# EasyEDA Pro project 2022-SS-ZT-1.eprj

# Schematic EDA_LQ——13P——u
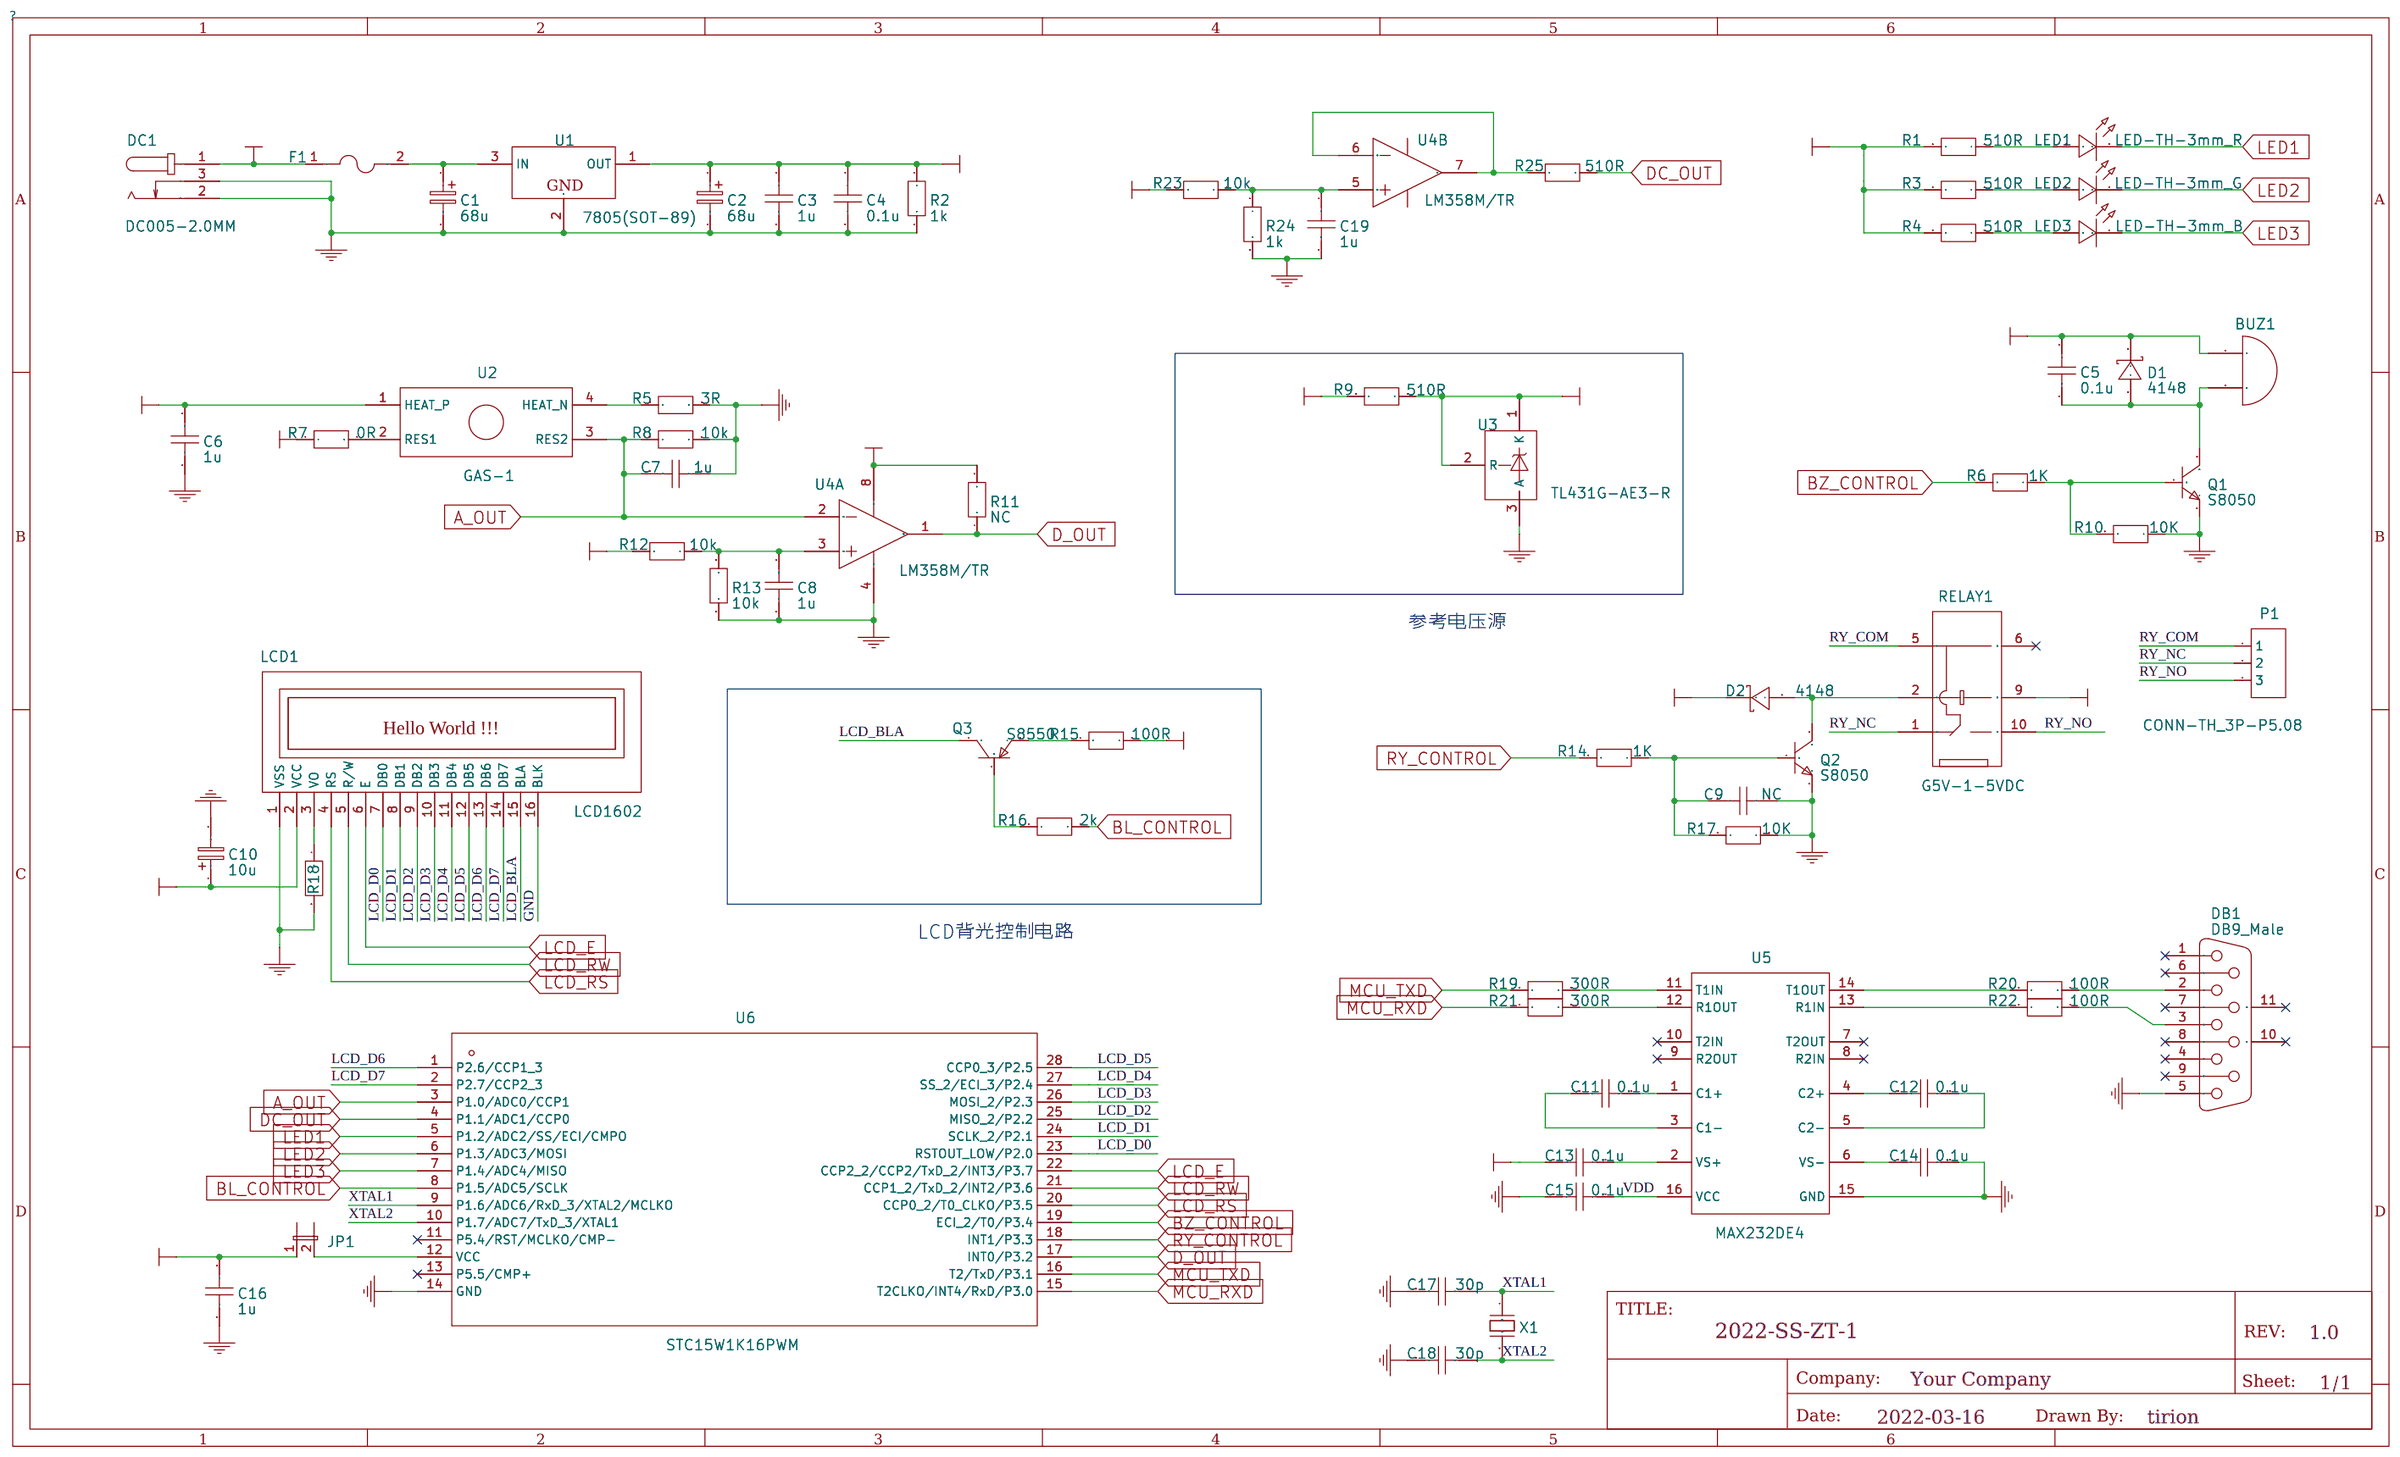
[diagram p0: schematic sheet]

## Parts
BUZ1  BUZ1  [BUZZ]
C1  68u  [CAP-D6.3×H5.5]
C2  68u  [CAP-D6.3×H5.5]
C3  1u  [C0805]
C4  0.1u  [C0805]
C5  0.1u  [C0805]
C6  1u  [C0805]
C7  1u  [C0805]
C8  1u  [C0805]
C9  NC  [C0805]
C10  10u  [CAP-D5.0×H5.5]
C11  0.1u  [C0805]
C12  0.1u  [C0805]
C13  0.1u  [C0805]
C14  0.1u  [C0805]
C15  0.1u  [C0805]
C16  1u  [C0805]
C17  30p  [C0805]
C18  30p  [C0805]
C19  1u  [C0805]
D1  4148  [SMA_L4.4-W2.8-LS5.4-RD]
D2  4148  [SMA_L4.4-W2.8-LS5.4-RD]
DB1  DB9_Male  [DSUB-TH_DMR-9P]
DC1  DC005-2.0MM  [DC-IN-TH_DC005]
F1  FUSE_F1812_FUSE  [F1812]
JP1  JUMPER2  [JUMPER2]
LCD1  LCD1602  [LCD1602]
LED1  LED-TH-3mm_R  [LED-TH_BD3.0_RED]
LED2  LED-TH-3mm_G  [LED-TH_BD3.0_GREEN]
LED3  LED-TH-3mm_B  [LED-TH_BD3.0_BLUE]
P1  CONN-TH_3P-P5.08  [CONN-TH_3P-P5.08]
Q1  S8050  [SOT-23-3_L2.9-W1.3-P1.90-LS2.4-BR]
Q2  S8050  [SOT-23-3_L2.9-W1.3-P1.90-LS2.4-BR]
Q3  S8550  [SOT-23-3_L2.9-W1.3-P1.90-LS2.4-BR]
R1  510R  [R0805]
R2  1k  [R0805]
R3  510R  [R0805]
R4  510R  [R0805]
R5  3R  [R0805]
R6  1K  [R0805]
R7  0R  [R0805]
R8  10k  [R0805]
R9  510R  [R0805]
R10  10K  [R0805]
R11  NC  [R0805]
R12  10k  [R0805]
R13  10k  [R0805]
R14  1K  [R0805]
R15  100R  [R0805]
R16  2k  [R0805]
R17  10K  [R0805]
R18  10k  [R0805]
R19  300R  [R0805]
R20  100R  [R0805]
R21  300R  [R0805]
R22  100R  [R0805]
R23  10k  [R0805]
R24  1k  [R0805]
R25  510R  [R0805]
RELAY1  G5V-1-5VDC  [RELAY-TH_G5V-1]
U1  7805(SOT-89)  [SOT-89-3_L4.5-W2.5-P1.50-LS4.2-BR]
U2  GAS-1  [GAS-1]
U3  TL431G-AE3-R  [SOT-23-3_L2.9-W1.3-P1.90-LS2.4-TR]
U4  LM358M/TR  [SOP-8_L4.9-W3.9-P1.27-LS6.0-BL]  (sections 1,2)
U5  MAX232DE4  [SOIC16N]
U6  STC15W1K16PWM  [SOP-28_L17.9-W7.5-P1.27-LS10.3-BL]
X1  12MHZ  [OSC-49U-1]

## Library data of the parts
BUZ1 = BUZ1
C1 C2 = 68u
C3 C6-C8 C16 C19 = 1u
C4 C5 C11-C15 = 0.1u
C9 R11 = NC
C10 = 10u
C17 C18 = 30p
D1 D2 = SS14: Supplier: LCSC; Manufacturer: MDD; Supplier Part: C2480; JLCPCB Part Class: Basic Part
DB1 = DB9_Male: Supplier Part: C185657; Supplier: LCSC; Manufacturer: Amphenol
DC1 = DC005-2.0MM: Supplier: LCSC; Manufacturer: SOFNG; Supplier Part: C111567
F1 = FUSE_F1812_FUSE: Supplier: LCSC; Supplier Part: C9900007509; JLCPCB Part Class: Extended Part
JP1 = JUMPER2: Jumper 2 Pin
LCD1 = LCM1602K-NSW-BBW: Manufacturer: LONTECH(厦门龙特); Supplier Part: C83275; Supplier: LCSC
LED1 = 204-10SDRD/S530-A3-L: Manufacturer: EVERLIGHT(台湾亿光); Supplier Part: C84774; Supplier: LCSC
LED2 = 204-10SYGD/S530-E3: Manufacturer: EVERLIGHT(台湾亿光); Supplier Part: C85161
LED3 = 204-10SUBC/S400-A4: Manufacturer: EVERLIGHT(台湾亿光); Supplier Part: C86881; Supplier: LCSC
P1 = CONN-TH_3P-P5.08: Supplier: LCSC
Q1 Q2 = S8050: Supplier: LCSC; Supplier Part: C916390; Manufacturer: JSMSEMI; JLCPCB Part Class: Extended Part
Q3 = S8550-H: Supplier: LCSC; Supplier Part: C699225; Manufacturer: Yangzhou Yangjie Elec Tech; JLCPCB Part Class: Extended Part
R1 R3 R4 R9 R25 = 510R
R2 R24 = 1k
R5 = 3R
R6 R14 = 1K
R7 = 0R
R8 R12 R13 R18 R23 = 10k
R10 R17 = 10K
R15 R20 R22 = 100R
R16 = 2k
R19 R21 = 300R
RELAY1 = G5V-1-5VDC: Supplier: LCSC; Manufacturer: OMRON; Supplier Part: C28695; JLCPCB Part Class: Extended Part
U1 = CJ78L05: Supplier: LCSC; Manufacturer: CJ; image: //image.lceda.cn/szlcsc/C2079.jpg; Supplier Part: C2079; Paste Type: expand
U2 = GAS-1
U3 = TL431G-AE3-R: Supplier: LCSC; Manufacturer: UTC; Supplier Part: C71130; JLCPCB Part Class: Extended Part
U4 = LM358M/TR: Supplier: LCSC; Supplier Part: C398078; Manufacturer: HGSEMI
U5 = MAX232DE4: Dual EIA-232 Driver  Receiver, 0 to 70 degC, 16-Pin SOIC (D), Green (RoHS  no SbBr)
U6 = STC15W1K16PWM: Supplier: LCSC; Manufacturer: STC; Supplier Part: C65670; JLCPCB Part Class: Extended Part
X1 = X49UD12MSD2SC: Supplier Part: undefined; Supplier: LCSC; Manufacturer: LCSC

## Nets
GND: C1.2 C2.2 C3.2 C4.2 C6.1 C7.1 C8.2 C9.2 C10.2 C14.2 C15.1 C16.1 C17.2 C18.2 C19.2 DB1.5 DC1.2 DC1.3 LCD1.1(VSS) LCD1.16(BLK) Q1.2(E) Q2.2(E) R2.2 R5.2 R8.2 R10.1 R13.2 R17.1 R18.2 R24.2 U1.2(GND) U3.3(A) U4.4(GND) U5.15(GND) U6.14(GND)
VDD: BUZ1.1(A) C2.1 C3.1 C4.1 C5.2 C6.2 C10.1 C13.1 C15.2 C16.2 D1.1(K) D2.1(K) JP1.1 LCD1.2(VCC) R1.2 R2.1 R3.2 R4.2 R9.2 R11.2 R15.2 RELAY1.9 U1.1(OUT) U2.1(HEAT_P) U4.8(VCC) U5.16(VCC)
A_OUT: C7.2 R8.1 U2.3(RES2) U4.2(1IN-) U6.3(P1.0/ADC0/CCP1)
BL_CONTROL: R16.2 U6.8(P1.5/ADC5/SCLK)
BZ_CONTROL: R6.2 U6.19(ECI_2/T0/P3.4)
D_OUT: R11.1 U4.1(1OUT) U6.17(INT0/P3.2)
DC_IN: DC1.1 F1.1 R23.2
DC_OUT: R25.1 U6.4(P1.1/ADC1/CCP0)
LCD_BLA: LCD1.15(BLA) Q3.3(C)
LCD_D0: LCD1.7(DB0) U6.23(RSTOUT_LOW/P2.0)
LCD_D1: LCD1.8(DB1) U6.24(SCLK_2/P2.1)
LCD_D2: LCD1.9(DB2) U6.25(MISO_2/P2.2)
LCD_D3: LCD1.10(DB3) U6.26(MOSI_2/P2.3)
LCD_D4: LCD1.11(DB4) U6.27(SS_2/ECI_3/P2.4)
LCD_D5: LCD1.12(DB5) U6.28(CCP0_3/P2.5)
LCD_D6: LCD1.13(DB6) U6.1(P2.6/CCP1_3)
LCD_D7: LCD1.14(DB7) U6.2(P2.7/CCP2_3)
LCD_E: LCD1.6(E) U6.22(CCP2_2/CCP2/TxD_2/INT3/P3.7)
LCD_RS: LCD1.4(RS) U6.20(CCP0_2/T0_CLKO/P3.5)
LCD_RW: LCD1.5(R/W) U6.21(CCP1_2/TxD_2/INT2/P3.6)
LED1: LED1.2 U6.5(P1.2/ADC2/SS/ECI/CMPO)
LED2: LED2.2 U6.6(P1.3/ADC3/MOSI)
LED3: LED3.2 U6.7(P1.4/ADC4/MISO)
MCU_RXD: R21.1 U6.15(T2CLKO/INT4/RxD/P3.0)
MCU_TXD: R19.1 U6.16(T2/TxD/P3.1)
RY_COM: P1.1 RELAY1.5
RY_CONTROL: R14.2 U6.18(INT1/P3.3)
RY_NC: P1.2 RELAY1.1
RY_NO: P1.3 RELAY1.10
VREF: R7.1 R9.1 R12.2 U3.1(K) U3.2(R)
XTAL1: C17.1 U6.9(P1.6/ADC6/RxD_3/XTAL2/MCLKO) X1.1(OSC1)
XTAL2: C18.1 U6.10(P1.7/ADC7/TxD_3/XTAL1) X1.2(OSC2)
$1N38: R5.1 U2.4(HEAT_N)
$1N129: C8.1 R12.1 R13.1 U4.3(1IN+)
$1N261: C11.2 U5.1(C1+)
$1N262: C11.1 U5.3(C1-)
$1N307: C13.2 U5.2(VS+)
$1N323: C12.1 U5.4(C2+)
$1N324: C12.2 U5.5(C2-)
$1N325: C14.1 U5.6(VS-)
$1N349: R19.2 U5.11(T1IN)
$1N361: R21.2 U5.12(R1OUT)
$1N384: R20.1 U5.14(T1OUT)
$1N385: DB1.2 R20.2
$1N395: R22.1 U5.13(R1IN)
$1N396: DB1.3 R22.2
$1N410: JP1.2 U6.12(VCC)
$1N453: D2.2(A) Q2.3(C) RELAY1.2
$1N454: C9.1 Q2.1(B) R14.1 R17.2
$1N534: Q1.1(B) R6.1 R10.2
$1N571: BUZ1.2(B) C5.1 D1.2(A) Q1.3(C)
$1N627: LCD1.3(VO) R18.1
$1N796: LED1.1 R1.1
$1N816: LED3.1 R4.1
$1N817: LED2.1 R3.1
$1N913: C1.1 F1.2 U1.3(IN)
$1N974: R25.2 U4.6(2IN-) U4.7(2OUT)
$1N997: C19.1 R23.1 R24.1 U4.5(2IN+)
$1N1047: R7.2 U2.2(RES1)
$1N2187: Q3.2(E) R15.1
$1N2198: Q3.1(B) R16.1

Not connected (* = marked no-connect by the designer): DB1 1* 4* 6* 7* 8* 9* 10(MH1)* 11(MH2)*; RELAY1 6*; U5 7(T2OUT)* 8(R2IN)* 9(R2OUT)* 10(T2IN)*; U6 11(P5.4/RST/MCLKO/CMP-)* 13(P5.5/CMP+)*

## Notes on the sheet
- 参考电压源
- LCD背光控制电路

# Board PCB
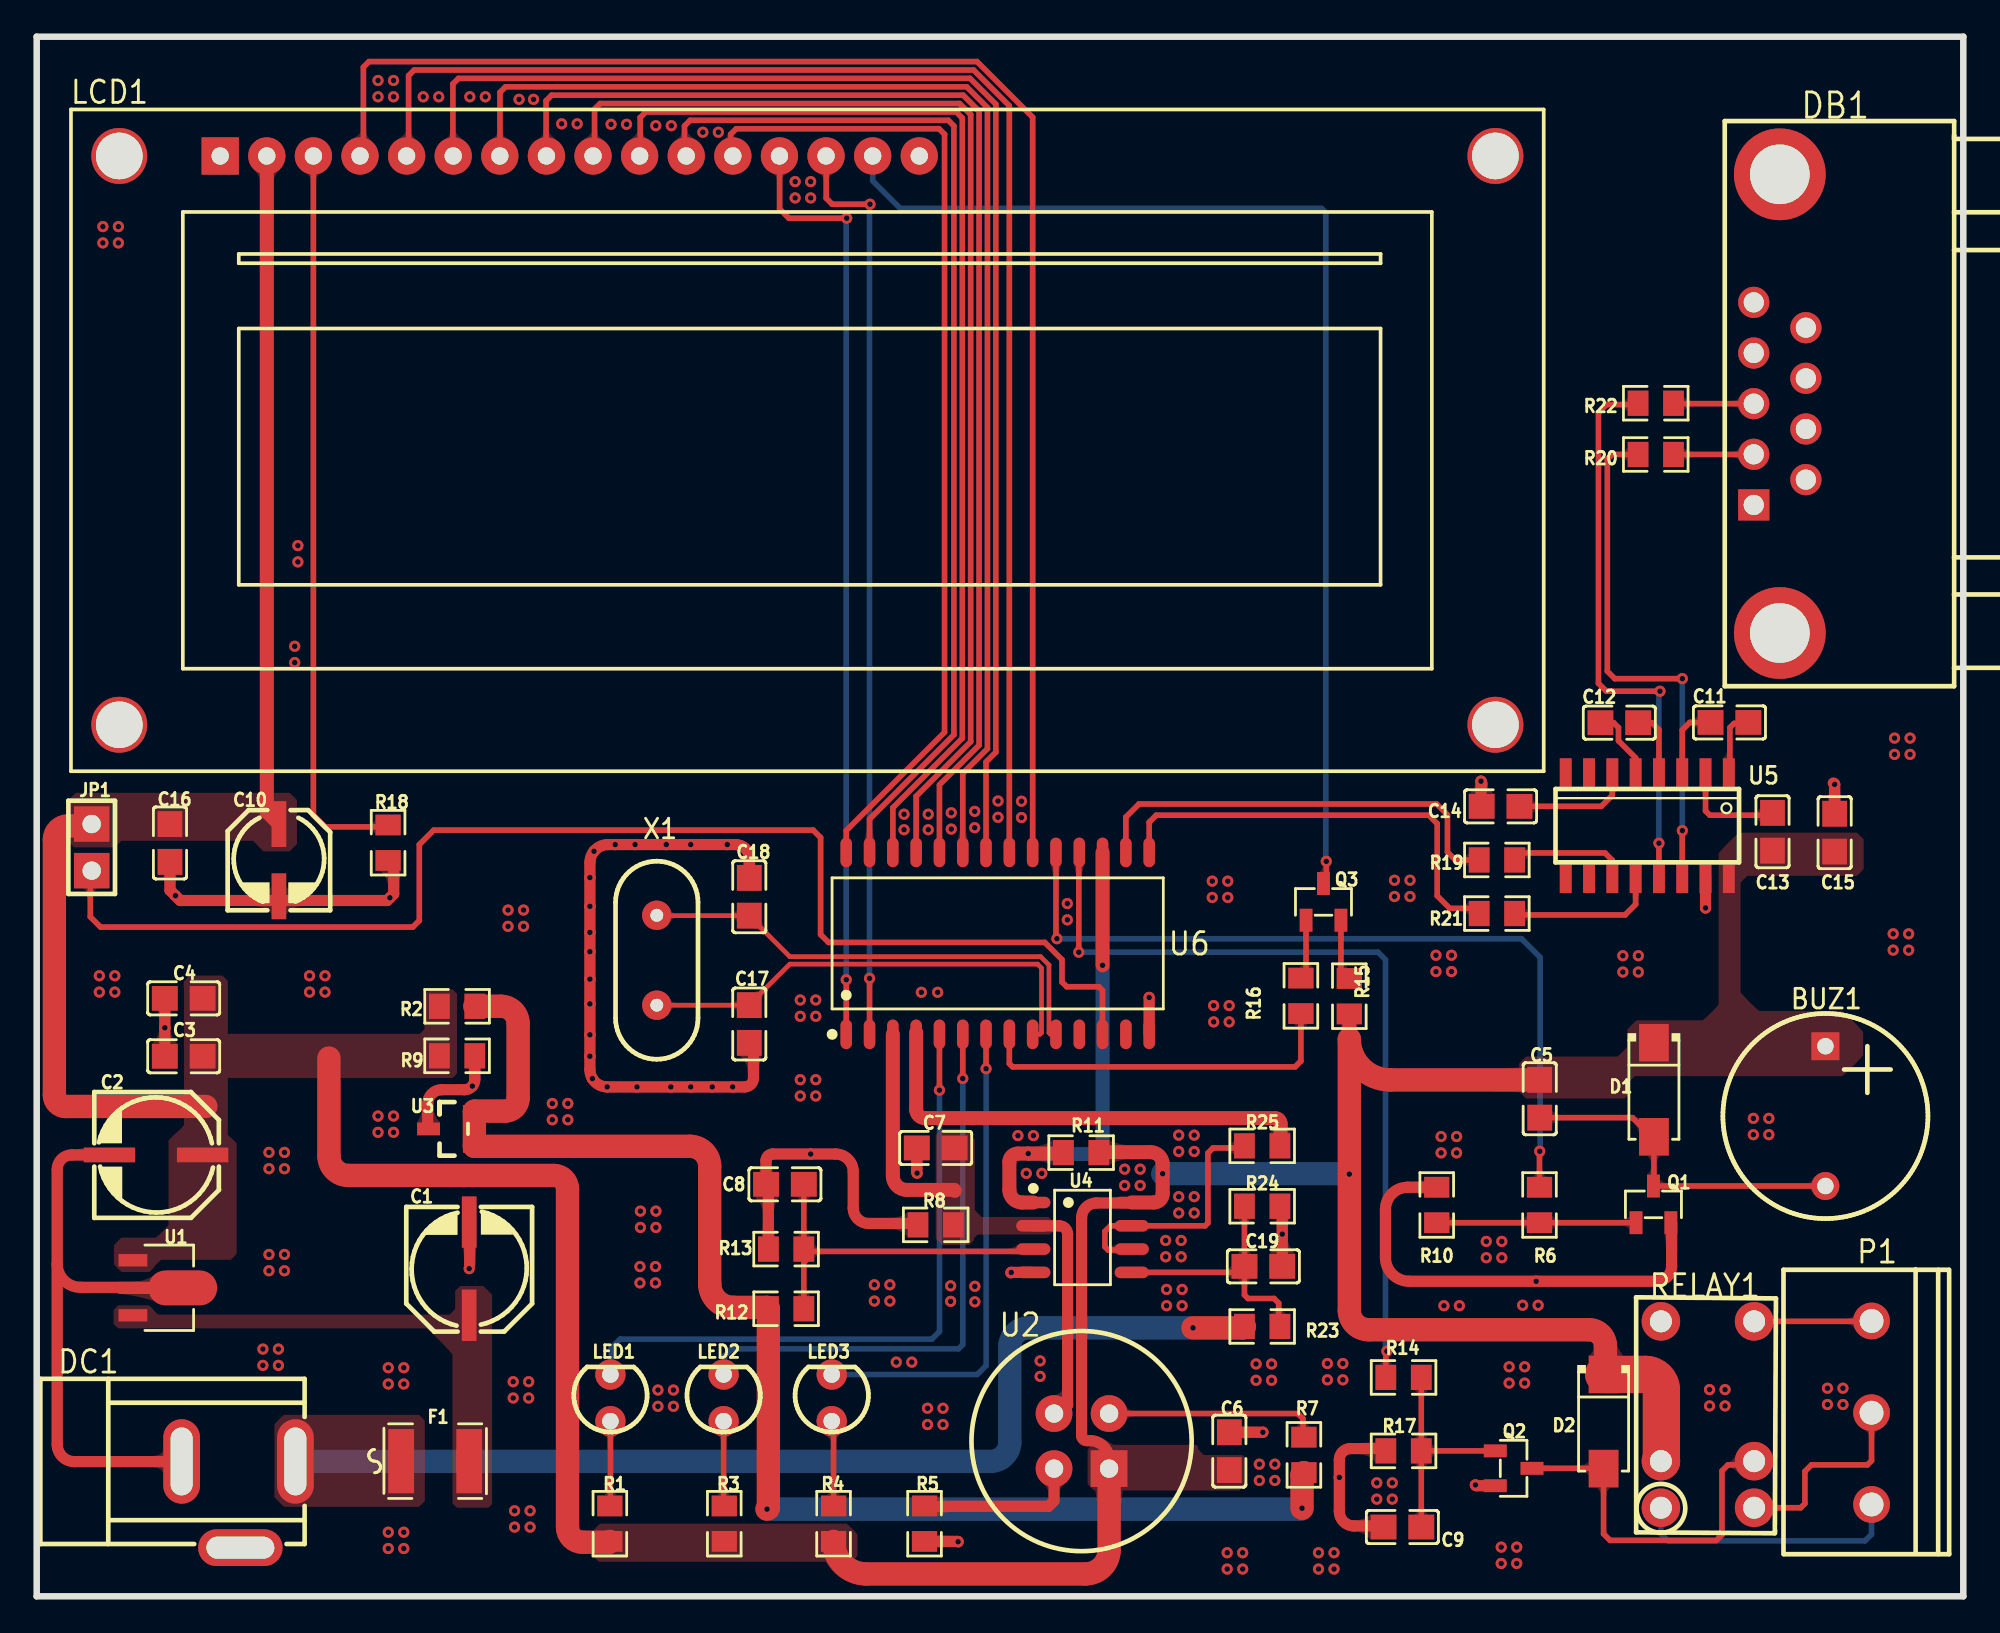
[diagram p1: board, top side]
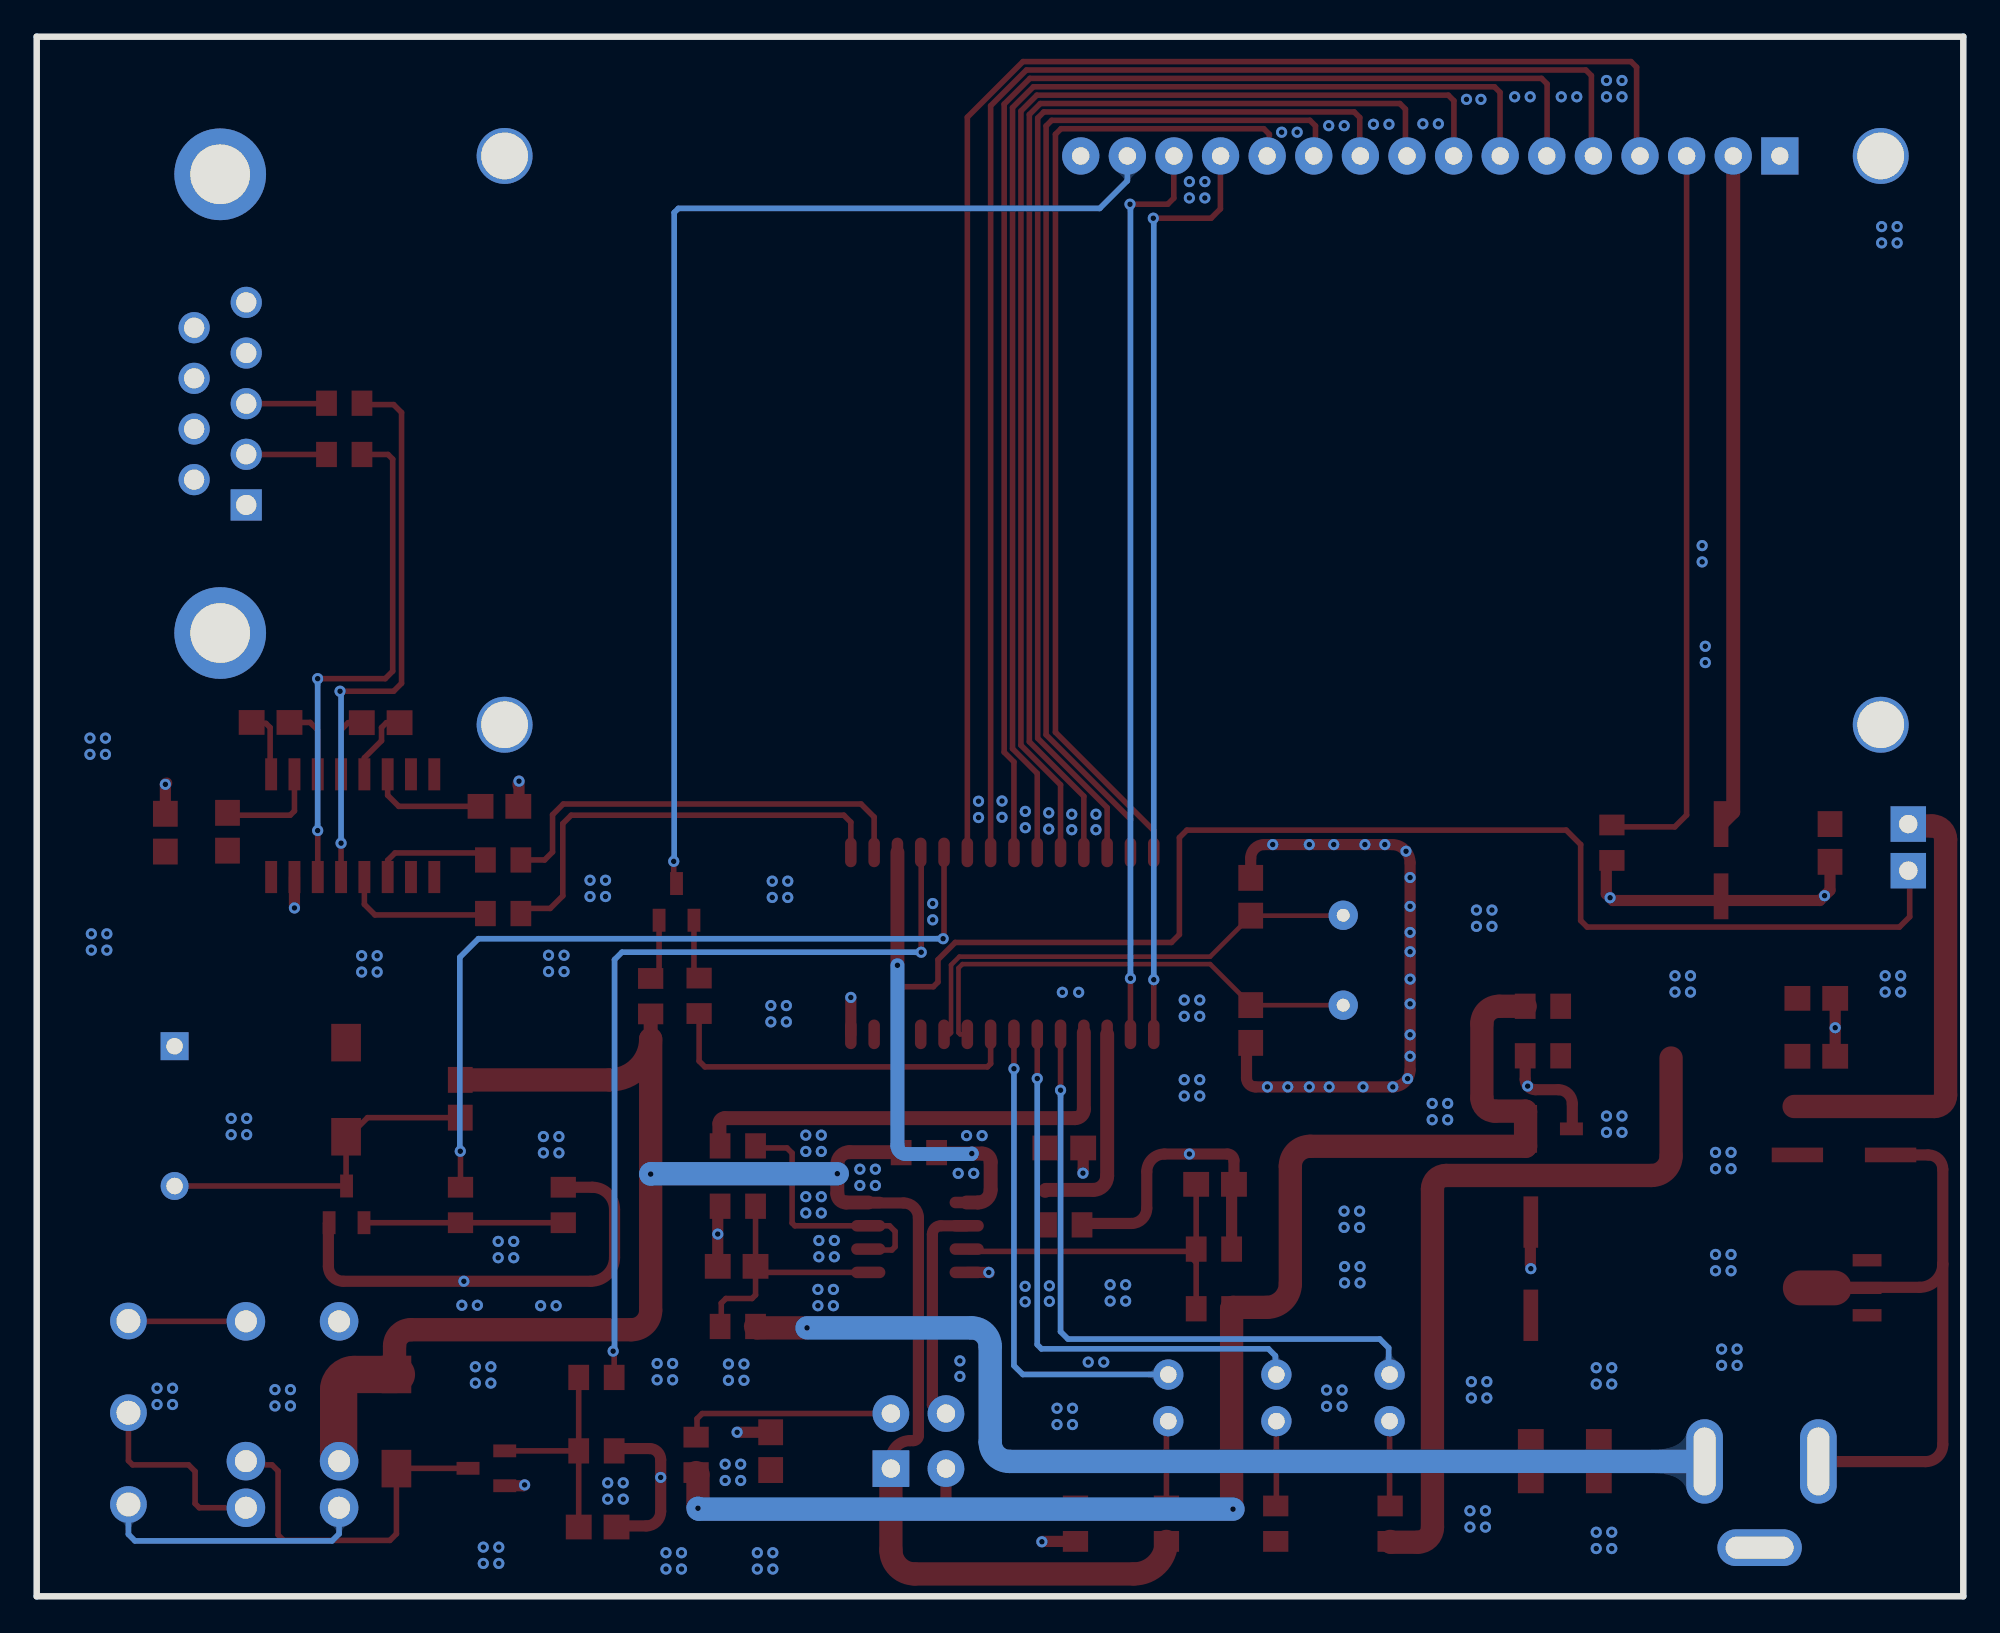
[diagram p2: board, bottom side, seen from below]

Outline 105 x 85 mm; copper layers: Top Layer, Bottom Layer. Coordinates in mm from the lower left corner of the outline.
Outline path: 0,85 105,85 105,0 0,0 0,85
Stack: Top Layer 0.035mm / Dielectric1 1.51mm FR4 er 4.5 / Bottom Layer 0.035mm

## Design rules (mm)
net XTAL1: DP1
net XTAL2: DP1
template: 用户自定义配置
spacing Default (default): track to track 0.152, other pairs 0 to 0.152
track width Default (default): min 0.305, default 0.305, max 25.4
track width PWR: min 0.305, default 0.61, max 2.54
differential pair differentialPair (default): width min 0.127, default 0.254, max 2.54; gap min 0.152, default 0.152
via Default (default): diameter min 0.61, default 0.61, max 100.025; hole min 0.305, default 0.305, max 59.995
net VDD uses PWR
net GND uses PWR
net VREF uses PWR
net DC_OUT uses PWR
net DC_IN uses PWR

## Placement (name value [footprint] x y rotation side)
BUZ1  BUZ1  [BUZZ]  97.49 29.98 270 top
C1  68u  [CAP-D6.3×H5.5]  23.57 20.4 270 top
C2  68u  [CAP-D6.3×H5.5]  3.96 24.05 0 top
C3  1u  [C0805]  8.01 29.43 180 top
C4  0.1u  [C0805]  8.01 32.59 180 top
C5  0.1u  [C0805]  81.91 27.12 90 top
C6  1u  [C0805]  65 7.91 270 top
C7  1u  [C0805]  49 24.44 0 top
C8  1u  [C0805]  40.78 22.45 180 top
C9  NC  [C0805]  74.43 3.78 180 top
C10  10u  [CAP-D5.0×H5.5]  13.2 38.15 90 top
C11  0.1u  [C0805]  92.25 47.63 0 top
C12  0.1u  [C0805]  86.25 47.61 180 top
C13  0.1u  [C0805]  94.6 41.67 90 top
C14  0.1u  [C0805]  79.78 43.05 180 top
C15  0.1u  [C0805]  97.99 41.62 270 top
C16  1u  [C0805]  7.26 41.06 90 top
C17  30p  [C0805]  38.84 31.19 270 top
C18  30p  [C0805]  38.84 38.13 90 top
C19  1u  [C0805]  66.85 17.98 0 top
D1  4148  [SMA_L4.4-W2.8-LS5.4-RD]  88.14 27.61 270 top
D2  4148  [SMA_L4.4-W2.8-LS5.4-RD]  85.4 9.53 270 top
DB1  DB9_Male  [DSUB-TH_DMR-9P]  95 65 0 top
DC1  DC005-2.0MM  [DC-IN-TH_DC005]  11 5 0 top
F1  FUSE_F1812_FUSE  [F1812]  21.72 7.37 0 top
JP1  -  [JUMPER2]  3 40.82 90 top
LCD1  -  [LCD1602]  42 63 0 top
LED1  LED-TH-3mm_R  [LED-TH_BD3.0_RED]  31.27 10.82 180 top
LED2  LED-TH-3mm_G  [LED-TH_BD3.0_GREEN]  37.44 10.82 180 top
LED3  LED-TH-3mm_B  [LED-TH_BD3.0_BLUE]  43.33 10.82 180 top
P1  -  [CONN-TH_3P-P5.08]  100 10 270 top
Q1  S8050  [SOT-23-3_L2.9-W1.3-P1.90-LS2.4-BR]  88.11 21.36 270 top
Q2  S8050  [SOT-23-3_L2.9-W1.3-P1.90-LS2.4-BR]  80.49 6.98 180 top
Q3  S8550  [SOT-23-3_L2.9-W1.3-P1.90-LS2.4-BR]  70.13 37.85 270 top
R1  510R  [R0805]  31.24 3.96 270 top
R2  1k  [R0805]  22.91 29.46 0 top
R3  510R  [R0805]  37.47 3.96 270 top
R4  510R  [R0805]  43.43 3.96 270 top
R5  3R  [R0805]  48.39 3.96 270 top
R6  1K  [R0805]  81.9 21.33 90 top
R7  0R  [R0805]  69.06 7.71 90 top
R8  10k  [R0805]  49 20.24 180 top
R9  510R  [R0805]  22.91 32.16 180 top
R10  10K  [R0805]  76.3 21.33 270 top
R11  NC  [R0805]  56.92 24.18 0 top
R12  10k  [R0805]  40.84 15.67 180 top
R13  10k  [R0805]  40.84 18.92 180 top
R14  1K  [R0805]  74.49 11.93 180 top
R15  100R  [R0805]  71.54 32.71 270 top
R16  2k  [R0805]  68.9 32.73 270 top
R17  10K  [R0805]  74.49 7.93 0 top
R18  10k  [R0805]  19.15 41.07 270 top
R19  300R  [R0805]  79.58 40.13 0 top
R20  100R  [R0805]  88.24 62.23 0 top
R21  300R  [R0805]  79.58 37.21 0 top
R22  100R  [R0805]  88.24 65.02 0 top
R23  10k  [R0805]  66.79 14.71 180 top
R24  1k  [R0805]  66.79 21.26 0 top
R25  510R  [R0805]  66.79 24.55 180 top
RELAY1  G5V-1-5VDC  [RELAY-TH_G5V-1]  91.06 9.91 90 top
U1  7805(SOT-89)  [SOT-89-3_L4.5-W2.5-P1.50-LS4.2-BR]  6.6 16.82 180 top
U2  -  [GAS-1]  58.45 6.96 180 top
U3  TL431G-AE3-R  [SOT-23-3_L2.9-W1.3-P1.90-LS2.4-TR]  22.61 25.48 0 top
U4  LM358M/TR  [SOP-8_L4.9-W3.9-P1.27-LS6.0-BL]  57 19.56 270 top
U5  MAX232DE4  [SOIC16N]  87.78 42 180 top
U6  STC15W1K16PWM  [SOP-28_L17.9-W7.5-P1.27-LS10.3-BL]  52.38 35.59 0 top
X1  12MHZ  [OSC-49U-1]  33.79 34.67 180 top

## Footprints (pads in the part's own frame, mm; a bottom-side part is the same pattern mirrored in y, then rotated)
BUZZ
  rect 1.524x1.524 hole 0.894x0.889: 1(0,0)
  round 1.524 hole 0.894x0.889: 2(7.62,0)
C0805
  rect 1.41x1.35 smd: 1(-1.03,0) 2(1.03,0)
CAP-D5.0×H5.5
  rect 2.5x0.8 smd: 1(3.937,0) 2(0,0)
CAP-D6.3×H5.5
  rect 2.8x0.8 smd: 1(5.08,0) 2(0,0)
CONN-TH_3P-P5.08
  round 2 hole 1.3: 1(-5.005,0) 2(-0.005,0) 3(4.995,0)
DC-IN-TH_DC005
  oval 2x4.6 hole 1.2x3.7: 1(3.1,2.35) 2(-3.1,2.35)
  oval 4.6x2 hole 3.7x1.2: 3(0.1,-2.35)
DSUB-TH_DMR-9P
  rect 1.7x1.7 hole 1.1: 1(-1.42,-5.52)
  round 1.7 hole 1.1: 2(-1.42,-2.76) 3(-1.42,0) 4(-1.42,2.76) 5(-1.42,5.52) 6(1.42,-4.14) 7(1.42,-1.38) 8(1.42,1.38) 9(1.42,4.14)
  round 5 hole 3.25: 10(0,12.5) 11(0,-12.5)
F1812
  rect 1.407x3.499 smd: 1(-1.853,0) 2(1.853,0)
GAS-1
  rect 2x2 hole 1: 1(0,0)
  round 2 hole 1: 2(0,-3) 3(3,-3) 4(3,0)
JUMPER2
  rect 1.931x1.931 hole 1.001: 1(1.27,0) 2(-1.27,0)
LCD1602
  round 3.048 hole 2.545x2.54: 0(-37.5,15.5) 17(-37.5,-15.5) 18(37.5,15.5) 19(37.5,-15.5)
  rect 2.032x2.032 hole 0.945: 1(-32,15.5)
  round 2.032 hole 0.945: 2(-29.46,15.5) 3(-26.92,15.5) 4(-24.38,15.5) 5(-21.84,15.5) 6(-19.3,15.5) 7(-16.76,15.5) 8(-14.22,15.5) 9(-11.68,15.5) 10(-9.14,15.5) 11(-6.6,15.5) 12(-4.06,15.5) 13(-1.52,15.5) 14(1.02,15.5) 15(3.56,15.5) 16(6.1,15.5)
LED-TH_BD3.0_BLUE
  round 1.651 hole 0.9: 1(0,1.27) 2(0,-1.27)
LED-TH_BD3.0_GREEN
  round 1.651 hole 0.9: 1(0,1.27) 2(0,-1.27)
LED-TH_BD3.0_RED
  round 1.651 hole 0.9: 1(0,1.27) 2(0,-1.27)
OSC-49U-1
  round 1.6 hole 0.7: 1(0,2.45) 2(0,-2.45)
R0805
  rect 1.133x1.377 smd: 1(-0.966,0) 2(0.966,0)
RELAY-TH_G5V-1
  round 2.1 hole 1.2: 1(-5.08,-2.54) 2(-2.54,-2.54) 5(5.08,-2.54) 6(5.08,2.54) 9(-2.54,2.54) 10(-5.08,2.54)
SMA_L4.4-W2.8-LS5.4-RD
  rect 2.046x1.62 smd: 1(-2.566,0) 2(2.566,0)
SOIC16N
  rect 0.65x1.75 smd: 1(-4.445,-2.799) 2(-3.175,-2.799) 3(-1.905,-2.799) 4(-0.635,-2.799) 5(0.635,-2.799) 6(1.905,-2.799) 7(3.175,-2.799) 8(4.445,-2.799) 9(4.445,2.799) 10(3.175,2.799) 11(1.905,2.799) 12(0.635,2.799) 13(-0.635,2.799) 14(-1.905,2.799) 15(-3.175,2.799) 16(-4.445,2.799)
SOP-8_L4.9-W3.9-P1.27-LS6.0-BL
  oval 0.63x1.865 smd: 1(-1.905,-2.683) 2(-0.635,-2.683) 3(0.635,-2.683) 4(1.905,-2.683) 5(1.905,2.683) 6(0.635,2.683) 7(-0.635,2.683) 8(-1.905,2.683)
SOP-28_L17.9-W7.5-P1.27-LS10.3-BL
  oval 0.63x1.615 smd: 1(-8.255,-4.957) 2(-6.985,-4.957) 3(-5.715,-4.957) 4(-4.445,-4.957) 5(-3.175,-4.957) 6(-1.905,-4.957) 7(-0.635,-4.957) 8(0.635,-4.957) 9(1.905,-4.957) 10(3.175,-4.957) 11(4.445,-4.957) 12(5.715,-4.957) 13(6.985,-4.957) 14(8.255,-4.957) 15(8.255,4.957) 16(6.985,4.957) 17(5.715,4.957) 18(4.445,4.957) 19(3.175,4.957) 20(1.905,4.957) 21(0.635,4.957) 22(-0.635,4.957) 23(-1.905,4.957) 24(-3.175,4.957) 25(-4.445,4.957) 26(-5.715,4.957) 27(-6.985,4.957) 28(-8.255,4.957)
SOT-23-3_L2.9-W1.3-P1.90-LS2.4-BR
  rect 1.25x0.7 smd: 1(1,-0.95) 2(1,0.95) 3(-1,0)
SOT-23-3_L2.9-W1.3-P1.90-LS2.4-TR
  rect 1.25x0.7 smd: 1(1.25,0.95) 2(1.25,-0.95) 3(-1.25,0)
SOT-89-3_L4.5-W2.5-P1.50-LS4.2-BR
  rect 1.575x0.672 smd: 1(1.356,-1.5) 3(1.356,1.5)
  custom 5.377x1.9 smd: 2(-1.356,0.009)

## Nets
As in the schematic.

Pads without a net: DB1 1 4 6 7 8 9 10 11; LCD1 0 17 18 19; RELAY1 6; U5 7 8 9 10; U6 11 13

## Via types
v1: diameter 0.61, hole 0.305, Top Layer to Bottom Layer, 300 vias

## Routing (per net, layer and track width the routed paths; a pad name or vN(x,y) marks a point on that pad's centre or on a via; arc(x,y) is an arc through that point)
GND: length 163.1
  Top Layer w0.61: 1.12,18.11 1.12,23.27 arc(1.35,23.82) 1.91,24.05 C2.2 ; 1.12,18.11 1.12,8.28 arc(1.39,7.62) 2.06,7.34 7.89,7.34 arc(7.9,7.34) DC1.2 ; 1.12,18.11 arc(1.49,17.21) 2.39,16.84 7.92,16.84 arc(7.95,16.83) U1.2 ; C4.2 v1(6.98,30.99) C3.2 ; C18.2 38.84,40.23 arc(38.62,40.75) 38.1,40.97 v1(37.64,40.97) v1(35.64,40.97) v1(34.31,40.97) v1(32.61,40.97) v1(31.53,40.97) 31.14,40.97 arc(30.72,40.87) v1(30.37,40.61) arc(30.21,40.31) 30.15,39.98 v1(30.15,39.17) v1(30.15,37.61) v1(30.15,36.19) v1(30.15,35.13) v1(30.15,33.64) v1(30.15,32.29) v1(30.15,30.6) v1(30.15,29.43) 30.15,28.7 arc(30.18,28.45) v1(30.29,28.21) arc(30.63,27.88) v1(31.09,27.76) v1(32.71,27.76) v1(34.56,27.76) v1(35.64,27.76) v1(36.82,27.76) v1(37.93,27.76) 38.58,27.76 arc(38.92,27.9) 39.06,28.25 39.06,29.93 arc(39,30.09) C17.2 ; 12.97,37.92 19.1,37.92 19.46,38.28 19.46,39.8 R18.2 ; 12.97,37.92 C10.2 ; 12.97,37.92 7.82,37.92 v1(7.56,38.18) 7.26,38.48 C16.1 ; U5.15 v1(90.95,37.52) ; C6.1 v1(66.83,8.94) ; C19.2 v1(67.88,19.74) 67.88,21.13 arc(67.85,21.22) R24.2 ; R2.2 23.88,28.17 arc(23.84,27.98) v1(23.74,27.81) arc(23.55,27.66) 23.32,27.61 22.07,27.61 arc(21.53,27.39) 21.31,26.85 21.31,25.52 arc(21.32,25.49) U3.3 ; v1(60.63,32.64) U6.14 ; R5.2 50.2,2.99 arc(50.21,2.99) v1(50.22,2.97) ; Q2.2 78.46,6.03 arc(78.42,6.04) v1(78.41,6.07) ; C15.1 v1(97.99,44.25) arc(97.97,44.3) 97.92,44.32 ; U4.4 v1(53.11,17.65) arc(53.09,17.65) 53.09,17.63 ; R10.1 74.72,22.29 arc(73.86,21.94) 73.51,21.08 73.51,18.47 arc(73.89,17.55) 74.8,17.17 v1(81.72,17.17) 88.29,17.17 arc(88.87,17.41) 89.1,17.98 89.1,20.32 arc(89.09,20.35) Q1.2 ; C7.1 47.97,23.28 arc(47.95,23.17) v1(47.98,23.06) ; R13.2 39.88,22.33 arc(39.84,22.42) C8.2 39.75,23.75 arc(39.85,24) 40.11,24.1 v1(42.18,24.1) 43.54,24.1 arc(44.22,23.82) 44.5,23.14 44.5,21.16 arc(44.75,20.57) 45.34,20.32 47.95,20.32 arc(48.01,20.3) R8.2 ; 23.6,18.09 23.6,20.37 arc(23.59,20.39) C1.2 ; C14.2 78.71,43.09 v1(78.71,44.42) arc(78.76,44.32) 78.77,44.2 ; R17.1 arc(73.49,8.01) 73.4,8.05 71.6,8.05 arc(71.17,7.87) 70.99,7.44 v1(70.99,6.48) 70.99,4.62 arc(71.22,4.07) 71.78,3.84 73.34,3.84 arc(73.38,3.82) C9.2
  vias: v1(3.41,33.82) v1(3.41,32.93) v1(3.61,74.65) v1(3.61,73.76) v1(4.26,33.82) v1(4.26,32.93) v1(4.45,74.65) v1(4.45,73.76) v1(12.33,13.47) v1(12.33,12.59) v1(12.66,24.19) v1(12.66,23.3) v1(12.66,18.63) v1(12.66,17.74) v1(13.17,13.47) v1(13.17,12.59) v1(13.5,24.19) v1(13.5,23.3) v1(13.5,18.63) v1(13.5,17.74) v1(14.06,51.78) v1(14.06,50.89) v1(14.23,57.26) v1(14.23,56.38) v1(14.87,33.82) v1(14.87,32.93) v1(15.71,33.82) v1(15.71,32.93) v1(18.6,82.61) v1(18.6,81.72) v1(18.6,26.17) v1(18.6,25.29) v1(19.25,38.07) v1(19.16,12.46) v1(19.16,11.57) v1(19.16,3.49) v1(19.16,2.6) v1(19.45,82.61) v1(19.45,81.72) v1(19.45,26.17) v1(19.45,25.29) v1(20.01,12.46) v1(20.01,11.57) v1(20.01,3.49) v1(20.01,2.6) v1(21.07,81.72) v1(21.91,81.72) v1(23.61,81.72) v1(23.57,17.86) v1(24.45,81.72) v1(25.69,37.4) v1(25.69,36.51) v1(25.97,11.7) v1(25.97,10.81) v1(26.04,4.66) v1(26.04,3.77) v1(26.29,81.58) v1(26.53,37.4) v1(26.53,36.51) v1(26.81,11.7) v1(26.81,10.81) v1(26.89,4.66) v1(26.89,3.77) v1(27.08,81.58) v1(28.1,26.86) v1(28.1,25.97) v1(28.61,80.25) v1(28.95,26.86) v1(28.95,25.97) v1(29.45,80.25) v1(31.3,80.23) v1(32.15,80.23) v1(32.9,20.99) v1(32.9,20.1) v1(32.88,17.97) v1(32.88,17.08) v1(33.74,80.15) v1(33.75,20.99) v1(33.75,20.1) v1(33.72,17.97) v1(33.72,17.08) v1(33.86,11.24) v1(33.86,10.35) v1(34.59,80.15) v1(34.7,11.24) v1(34.7,10.35) v1(36.31,79.79) v1(37.15,79.79) v1(41.34,77.1) v1(41.34,76.21) v1(41.61,32.5) v1(41.61,31.61) v1(41.61,28.16) v1(41.61,27.27) v1(42.18,77.1) v1(42.18,76.21) v1(42.46,32.5) v1(42.46,31.61) v1(42.46,28.16) v1(42.46,27.27) v1(45.65,16.98) v1(45.65,16.09) v1(46.5,16.98) v1(46.5,16.09) v1(46.85,12.76) v1(47.27,42.62) v1(47.27,41.78) v1(47.69,12.76) v1(48.21,32.92) v1(48.55,10.25) v1(48.55,9.36) v1(48.59,42.62) v1(48.59,41.78) v1(49.1,32.92) v1(49.39,10.25) v1(49.39,9.36) v1(49.84,42.7) v1(49.84,41.81) v1(49.81,16.92) v1(49.81,16.07) v1(51.12,42.78) v1(51.12,41.89) v1(51.13,16.89) v1(51.13,16.05) v1(52.39,43.34) v1(52.39,42.46) v1(53.48,25.11) v1(53.67,43.33) v1(53.67,42.44) v1(53.93,23.05) v1(54.32,25.11) v1(54.69,12.83) v1(54.69,11.99) v1(54.78,23.05) v1(56.17,37.76) v1(56.17,36.87) v1(59.29,23.28) v1(59.29,22.39) v1(60.14,23.28) v1(60.14,22.39) v1(61.53,19.39) v1(61.53,18.5) v1(61.58,16.73) v1(61.58,15.84) v1(62.24,25.13) v1(62.24,24.24) v1(62.24,21.78) v1(62.24,20.89) v1(62.37,19.39) v1(62.37,18.5) v1(62.42,16.73) v1(62.42,15.84) v1(63.08,25.13) v1(63.08,24.24) v1(63.08,21.78) v1(63.08,20.89) v1(64.07,38.98) v1(64.07,38.09) v1(64.14,32.19) v1(64.14,31.31) v1(64.91,38.98) v1(64.91,38.09) v1(64.88,2.38) v1(64.88,1.49) v1(64.99,32.19) v1(64.99,31.31) v1(65.73,2.38) v1(65.73,1.49) v1(66.46,12.66) v1(66.46,11.77) v1(66.63,7.2) v1(66.63,6.31) v1(67.3,12.66) v1(67.3,11.77) v1(67.48,7.2) v1(67.48,6.31) v1(69.86,2.38) v1(69.86,1.49) v1(70.34,12.69) v1(70.34,11.8) v1(70.7,2.38) v1(70.7,1.49) v1(71.19,12.69) v1(71.19,11.8) v1(73.03,6.19) v1(73.03,5.3) v1(73.88,6.19) v1(73.88,5.3) v1(74,39.03) v1(74,38.14) v1(74.84,39.03) v1(74.84,38.14) v1(76.26,34.94) v1(76.26,34.05) v1(76.54,25.06) v1(76.54,24.17) v1(76.69,15.84) v1(77.1,34.94) v1(77.1,34.05) v1(77.38,25.06) v1(77.38,24.17) v1(77.54,15.84) v1(79,19.34) v1(79,18.45) v1(79.85,19.34) v1(79.85,18.45) v1(79.82,2.68) v1(79.82,1.79) v1(80.25,12.51) v1(80.25,11.62) v1(80.66,2.68) v1(80.66,1.79) v1(80.98,15.86) v1(81.09,12.51) v1(81.09,11.62) v1(81.83,15.86) v1(86.45,34.91) v1(86.45,34.02) v1(87.29,34.91) v1(87.29,34.02) v1(91.17,11.26) v1(91.17,10.38) v1(92.01,11.26) v1(92.01,10.38) v1(93.56,26.05) v1(93.56,25.16) v1(94.4,26.05) v1(94.4,25.16) v1(97.6,11.34) v1(97.6,10.45) v1(98.44,11.34) v1(98.44,10.45) v1(101.18,36.11) v1(101.18,35.22) v1(101.25,46.77) v1(101.25,45.89) v1(102.02,36.11) v1(102.02,35.22) v1(102.1,46.77) v1(102.1,45.89)
VDD: length 211
  Top Layer w0.61: U2.1 58.45,7.44 arc(58.14,8.18) 57.4,8.48 57.23,8.48 arc(57.03,8.57) 56.95,8.76 56.95,20.62 arc(57.18,21.2) 57.76,21.44 59.65,21.44 arc(59.67,21.44) U4.8
  Top Layer w0.762: C10.1 12.54,42.75 LCD1.2 ; R15.2 71.54,30.37 ; U4.8 60.88,21.46 arc(61.23,21.6) 61.37,21.95 v1(61.37,23.03) 61.37,23.55 arc(61.17,24.01) 60.71,24.21 57.91,24.21 arc(57.9,24.2) R11.2
  Top Layer w1.27: U2.1 58.45,2.51 arc(58.07,1.6) 57.15,1.22 45.2,1.22 arc(43.95,1.74) R4.2 ; 9.22,26.7 1.58,26.7 arc(1.14,26.87) 0.97,27.31 0.97,41.25 arc(1.18,41.77) 1.7,41.99 2.9,41.99 arc(2.97,42.02) JP1.1 ; 15.93,29.34 15.93,24 arc(16.24,23.25) 16.99,22.94 28.19,22.94 arc(28.71,22.72) 28.93,22.2 28.93,3.76 arc(29.17,3.18) 29.74,2.95 31.19,2.95 arc(31.22,2.96) R1.2 ; D2.1 arc(85.47,12.12) 85.5,12.19 85.5,13.64 arc(85.24,14.27) 84.61,14.53 72.59,14.53 arc(71.85,14.84) 71.54,15.58 v1(71.54,23.01) 71.54,30.37 arc(72.19,28.79) 73.76,28.14 81.91,28.14 arc(81.91,28.14) C5.2
  Top Layer w2.032: D2.1 87.71,12.09 arc(88.3,11.84) 88.54,11.25 88.54,7.39 arc(88.54,7.37) RELAY1.9
  Bottom Layer w1.27: v1(71.54,23.01) 71.52,23.03 v1(61.37,23.03)
A_OUT: length 23.9
  Top Layer w0.61: 54.31,20.19 55.73,20.19 arc(56.05,20.06) 56.19,19.74 56.19,10.43 arc(55.88,10.09) U2.3
  Top Layer w0.762: U6.3 46.66,22.91 arc(46.88,22.37) 47.42,22.15 49.99,22.15 arc(50.02,22.13) 50.04,22.1
BL_CONTROL: length 20.3
  Top Layer w0.305: 68.9,31.76 68.9,29.17 68.58,28.85 53.19,28.85 53.01,29.03 U6.8
BZ_CONTROL: length 44
  Top Layer w0.305: R6.2 81.9,24.24 v1(81.91,24.26) ; 55.55,40.54 55.55,35.89 v1(55.6,35.84)
  Bottom Layer w0.305: v1(81.91,24.26) 81.94,24.28 81.94,34.82 80.92,35.84 v1(55.6,35.84)
D_OUT: length 26.8
  Top Layer w0.762: U4.1 53.7,21.46 arc(53.21,21.66) 53.01,22.15 53.01,23.67 arc(53.14,24) 53.47,24.13 v1(54.04,24.13) 55.9,24.13 arc(55.94,24.14) R11.1 ; v1(58.09,34.39) 58.09,40.54
  Bottom Layer w0.762: v1(58.09,34.39) 58.09,24.56 arc(57.96,24.24) 57.63,24.1 54.06,24.1 arc(54.04,24.11) v1(54.04,24.13)
DC_IN: length 58.2
  Top Layer w1.27: v1(63.02,14.63) 65.75,14.63 arc(65.8,14.65) 65.82,14.71
  Bottom Layer w1.27: DC1.1 51.98,7.35 arc(52.73,7.66) 53.03,8.41 53.03,13.61 arc(53.33,14.33) 54.05,14.63 v1(63.02,14.63)
DC_OUT: length 25.6
  Top Layer w0.762: 47.93,30.73 47.93,26.54 arc(48.07,26.2) 48.41,26.06 67.49,26.06 arc(67.7,25.97) 67.79,25.76 67.79,24.69 arc(67.78,24.66) 67.76,24.65
LCD_BLA: length 63.4
  Top Layer w0.305: Q3.3 70.28,39 v1(70.28,40.06)
  Bottom Layer w0.305: v1(70.28,40.06) 70.26,40.08 70.26,75.41 70.03,75.64 47.07,75.64 45.56,77.15 LCD1.15
LCD_D0: length 71.8
  Top Layer w0.305: 50.47,40.54 50.47,44.85 51.82,46.2 51.82,81.13 50.68,82.27 25.55,82.27 25.25,81.97 25.25,78.51 LCD1.7
LCD_D1: length 68.4
  Top Layer w0.305: 49.2,40.54 49.2,44.23 51.36,46.39 51.36,80.95 50.49,81.81 28.07,81.81 27.76,81.51 27.76,78.52 LCD1.8
LCD_D2: length 64.9
  Top Layer w0.305: 47.93,40.54 47.93,43.6 50.9,46.57 50.9,80.76 50.3,81.36 30.71,81.36 30.4,81.05 30.4,78.58 LCD1.9
LCD_D3: length 61.5
  Top Layer w0.305: 46.66,40.54 46.66,42.98 50.44,46.76 50.44,80.57 50.11,80.9 33.2,80.9 32.89,80.59 32.89,78.53 LCD1.10
LCD_D4: length 58.1
  Top Layer w0.305: 45.39,40.54 45.39,42.36 49.99,46.95 49.99,80.14 49.68,80.44 35.61,80.44 35.31,80.14 35.31,78.59 LCD1.11
LCD_D5: length 54.5
  Top Layer w0.305: 44.12,40.54 44.12,41.73 49.48,47.09 49.48,79.68 49.17,79.98 38.13,79.98 37.82,79.68 37.82,78.62 LCD1.12
LCD_D6: length 51.2
  Top Layer w0.305: v1(44.15,75.11) 41,75.11 40.49,75.62 40.49,78.49 LCD1.13 ; U6.1 v1(44.12,33.6)
  Bottom Layer w0.305: v1(44.12,33.6) 44.12,75.08 v1(44.15,75.11)
LCD_D7: length 50.1
  Top Layer w0.305: v1(45.41,75.87) 43.36,75.87 43.03,76.2 43.03,78.49 LCD1.14 ; U6.2 v1(45.39,33.68)
  Bottom Layer w0.305: v1(45.39,33.68) 45.39,75.84 v1(45.41,75.87)
LCD_E: length 75.2
  Top Layer w0.305: 51.74,40.54 51.74,45.47 52.27,46.01 52.27,81.32 50.87,82.73 22.99,82.73 22.68,82.42 22.68,78.52 LCD1.6
LCD_RS: length 82.8
  Top Layer w0.305: 54.28,40.54 54.28,80.61 51.25,83.64 18.11,83.64 17.81,83.34 17.81,78.69 LCD1.4
LCD_RW: length 78.8
  Top Layer w0.305: 53.01,40.54 53.01,81.23 51.06,83.19 20.57,83.19 20.27,82.88 20.27,78.61 LCD1.5
LED1: length 35.9
  Top Layer w0.305: U6.5 v1(49.2,27.58)
  Bottom Layer w0.305: v1(49.2,27.58) 49.2,14.43 48.79,14.02 31.8,14.02 31.32,13.54 31.32,12.14 LED1.2
LED2: length 31.2
  Top Layer w0.305: U6.6 v1(50.47,28.22)
  Bottom Layer w0.305: v1(50.47,28.22) 50.47,13.72 50.24,13.49 37.87,13.49 37.49,13.11 37.49,12.14 LED2.2
LED3: length 26.7
  Top Layer w0.305: U6.7 v1(51.74,28.75)
  Bottom Layer w0.305: v1(51.74,28.75) 51.74,12.57 51.26,12.09 43.33,12.09 LED3.2
MCU_RXD: length 24.3
  Top Layer w0.305: R21.1 78.33,37.49 77.01,37.49 76.33,38.18 76.33,42.11 75.87,42.57 61.01,42.57 60.63,42.19 60.63,40.54
MCU_TXD: length 23.9
  Top Layer w0.305: R19.1 77.32,40.13 76.89,40.56 76.89,42.6 76.3,43.18 60.07,43.18 59.36,42.47 59.36,40.54
RY_COM: length 6.4
  Top Layer w0.305: P1.1 99.98,14.99 RELAY1.5
RY_CONTROL: length 45
  Top Layer w0.305: v1(73.58,13.36) 73.53,13.3 R14.2 ; 56.82,40.54 56.79,40.52 v1(56.79,35.1)
  Bottom Layer w0.305: 73.51,13.44 73.51,34.7 73.1,35.1 v1(56.79,35.1)
RY_NC: length 11.1
  Top Layer w0.305: RELAY1.1 96.14,4.83 96.37,5.05 96.37,6.81 96.72,7.16 99.77,7.16 100,7.39 P1.2
RY_NO: length 14.8
  Bottom Layer w0.305: P1.3 100,3.38 99.64,3.02 88.9,3.02 88.52,3.4 RELAY1.10
VREF: length 77.6
  Top Layer w1.27: v1(68.96,4.8) 68.96,6.64 arc(68.99,6.71) R7.1 ; R9.1 25.3,32.16 arc(25.96,31.88) 26.24,31.22 26.24,27.15 arc(26.03,26.65) 25.53,26.44 23.87,26.44 arc(23.86,26.44) U3.1 U3.2 35.6,24.53 arc(36.36,24.21) 36.68,23.44 36.68,17.04 arc(37.06,16.13) 37.97,15.75 39.8,15.75 arc(39.85,15.73) R12.2 39.88,4.82 arc(39.85,4.77) v1(39.8,4.75)
  Bottom Layer w1.27: v1(39.8,4.75) 68.91,4.75 arc(68.95,4.76) v1(68.96,4.8)
XTAL1: length 26.1
  Top Layer w0.254: X1.1 38.83,32.22 C17.1 ; 54.25,30.63 54.67,30.63 54.76,30.72 54.76,34.24 54.55,34.45 41.04,34.45 38.81,32.22
XTAL2: length 26.6
  Top Layer w0.254: X1.2 33.81,37.1 38.81,37.1 ; 55.52,30.63 55.26,30.63 55.17,30.72 55.17,34.41 54.72,34.86 41.04,34.86 38.81,37.1 ; 38.81,37.1 C18.1
$1N38: length 8.9
  Top Layer w0.61: U2.4 55.45,5.2 55.14,4.9 48.41,4.9 R5.1
$1N129: length 19.4
  Top Layer w0.305: C8.1 R13.1 41.81,18.2 ; 41.81,18.2 R12.1 ; 41.81,18.2 41.95,18.34 ; 41.95,18.8 54.19,18.8 U4.3
$1N261: length 3.7
  Top Layer w0.305: U5.1 92.28,44.86 92.28,47.35 92.51,47.57 93.23,47.57 C11.2
$1N262: length 4.1
  Top Layer w0.305: U5.3 89.68,47.21 90.09,47.63 C11.1
$1N307: length 5.8
  Top Layer w0.305: U5.2 90.95,42.8 91.19,42.57 94.47,42.57 C13.2
$1N323: length 3.7
  Top Layer w0.305: C12.1 88.02,47.61 88.41,47.22 U5.4
$1N324: length 4
  Top Layer w0.305: 85.22,47.61 85.94,47.61 86.21,47.35 86.21,46.63 87.14,45.69 U5.5
$1N325: length 6.5
  Top Layer w0.305: C14.1 85.27,43.05 85.87,43.66 U5.6
$1N349: length 6.6
  Top Layer w0.305: U5.11 85.87,40.11 85.47,40.51 80.93,40.51 80.54,40.13
$1N361: length 8.4
  Top Layer w0.305: U5.12 87.14,37.71 86.56,37.14 80.62,37.14 80.54,37.21
$1N384: length 28.4
  Top Layer w0.305: v1(89.69,41.73) 89.68,41.73 U5.14 ; v1(89.69,50.01) 86,50.01 85.6,50.42 85.6,61.98 85.85,62.23 R20.1
  Bottom Layer w0.305: v1(89.69,41.73) v1(89.69,50.01)
$1N385: length 4.4
  Top Layer w0.305: R20.2 93.57,62.23 arc(93.58,62.23) DB1.2
$1N395: length 30.8
  Top Layer w0.305: v1(88.47,49.33) 85.55,49.33 85.12,49.76 85.12,64.52 85.55,64.95 87.2,64.95 R22.1 ; U5.13 v1(88.41,41.05)
  Bottom Layer w0.305: v1(88.47,49.33) 88.41,49.27 v1(88.41,41.05)
$1N396: length 4.4
  Top Layer w0.305: DB1.3 89.23,65 arc(89.21,65.01) R22.2
$1N410: length 72.4
  Top Layer w0.305: JP1.2 2.92,39.47 2.92,37.03 3.48,36.47 20.5,36.47 20.85,36.83 20.85,40.97 21.64,41.76 42.32,41.76 42.72,41.35 42.72,36.07 43.15,35.64 54.94,35.64 55.88,34.7 55.88,33.48 56.13,33.22 57.89,33.22 58.09,33.02 U6.12
$1N453: length 19.6
  Top Layer w0.305: RELAY1.2 93.4,7.16 92.18,7.16 91.85,6.83 91.85,3.35 91.54,3.05 85.75,3.05 85.4,3.4 D2.2 85.38,6.98 Q2.3
$1N454: length 12.2
  Top Layer w0.305: C9.1 R17.2 ; R17.2 R14.1 ; R17.2 Q2.1
$1N534: length 10.9
  Top Layer w0.305: R10.2 R6.1 Q1.1
$1N571: length 18.7
  Top Layer w0.305: BUZ1.2 Q1.3 88.14,22.39 D1.2 88.01,25.04 86.97,26.09 C5.1
$1N627: length 40.3
  Top Layer w0.305: LCD1.3 15.08,42.58 15.72,41.94 19.05,41.94 R18.1
$1N796: length 4.6
  Top Layer w0.305: LED1.1 31.27,4.95 arc(31.26,4.93) R1.1
$1N816: length 4.7
  Top Layer w0.305: R4.1 43.43,9.44 arc(43.4,9.52) LED3.1
$1N817: length 4.6
  Top Layer w0.305: LED2.1 37.44,4.96 arc(37.45,4.94) R3.1
$1N974: length 14.2
  Top Layer w0.305: U4.6 59.63,18.87 58.39,18.87 58.22,19.05 58.22,19.89 58.52,20.19 63.68,20.19 63.83,20.35 63.83,24.16 64.11,24.44 65.71,24.44 65.82,24.55
$1N997: length 14.5
  Top Layer w0.305: 65.82,21.26 C19.1 ; C19.1 65.82,16.42 66.01,16.23 67.44,16.23 67.69,15.98 67.69,14.77 R23.1 ; C19.1 65.49,17.65 U4.5
$1N1047: length 11.7
  Top Layer w0.305: R7.2 69.01,8.73 69.01,9.68 68.73,9.96 U2.2
$1N2187: length 3.4
  Top Layer w0.305: Q3.2 71.08,34.13 R15.1
$1N2198: length 3.3
  Top Layer w0.305: Q3.1 69.18,33.97 arc(69.1,33.78) 68.9,33.69

## Copper pours and planes (outline as drawn; the poured copper is in the pictures)
GND on Top Layer: -17.47,104.83 174.73,104.83 174.73,-46.46 -17.47,-46.46
GND on Bottom Layer: -15.6,107.44 194.62,107.44 194.62,-62.97 -15.6,-62.97
VDD on Top Layer: 4.22,33.83 10.9,33.83 10.9,17.68 4.22,17.68
VDD on Top Layer: 30.32,3.96 44.73,3.96 44.73,1.88 30.32,1.88
VDD on Top Layer: 9.93,33.07 22.91,33.07 22.91,28.25 9.93,28.25
VDD on Top Layer: 80.79,41.62 99.57,41.62 99.57,27.13 80.79,27.13
VDD on Top Layer: 1.73,43.79 14.19,43.79 14.19,40.6 1.73,40.6
VDD on Top Layer: 57.28,8.25 65.9,8.25 65.9,5.77 57.28,5.77
A_OUT on Top Layer: 49,25.48 55.48,25.48 55.48,19.15 49,19.15
DC_IN on Top Layer: 12.95,9.89 21.16,9.89 21.16,4.88 12.95,4.88
$1N913 on Top Layer: 4.19,16.92 24.82,16.92 24.82,4.83 4.19,4.83

Small or netless copper shapes (teardrops, artwork), in the pictures only: 190 on Top Layer, 23 on Bottom Layer
